# Altium schematic sheet project_pankov_connectors.SchDoc: =title_line_1 + title_line_2
size 594 x 420 mm; SheetNumber: n
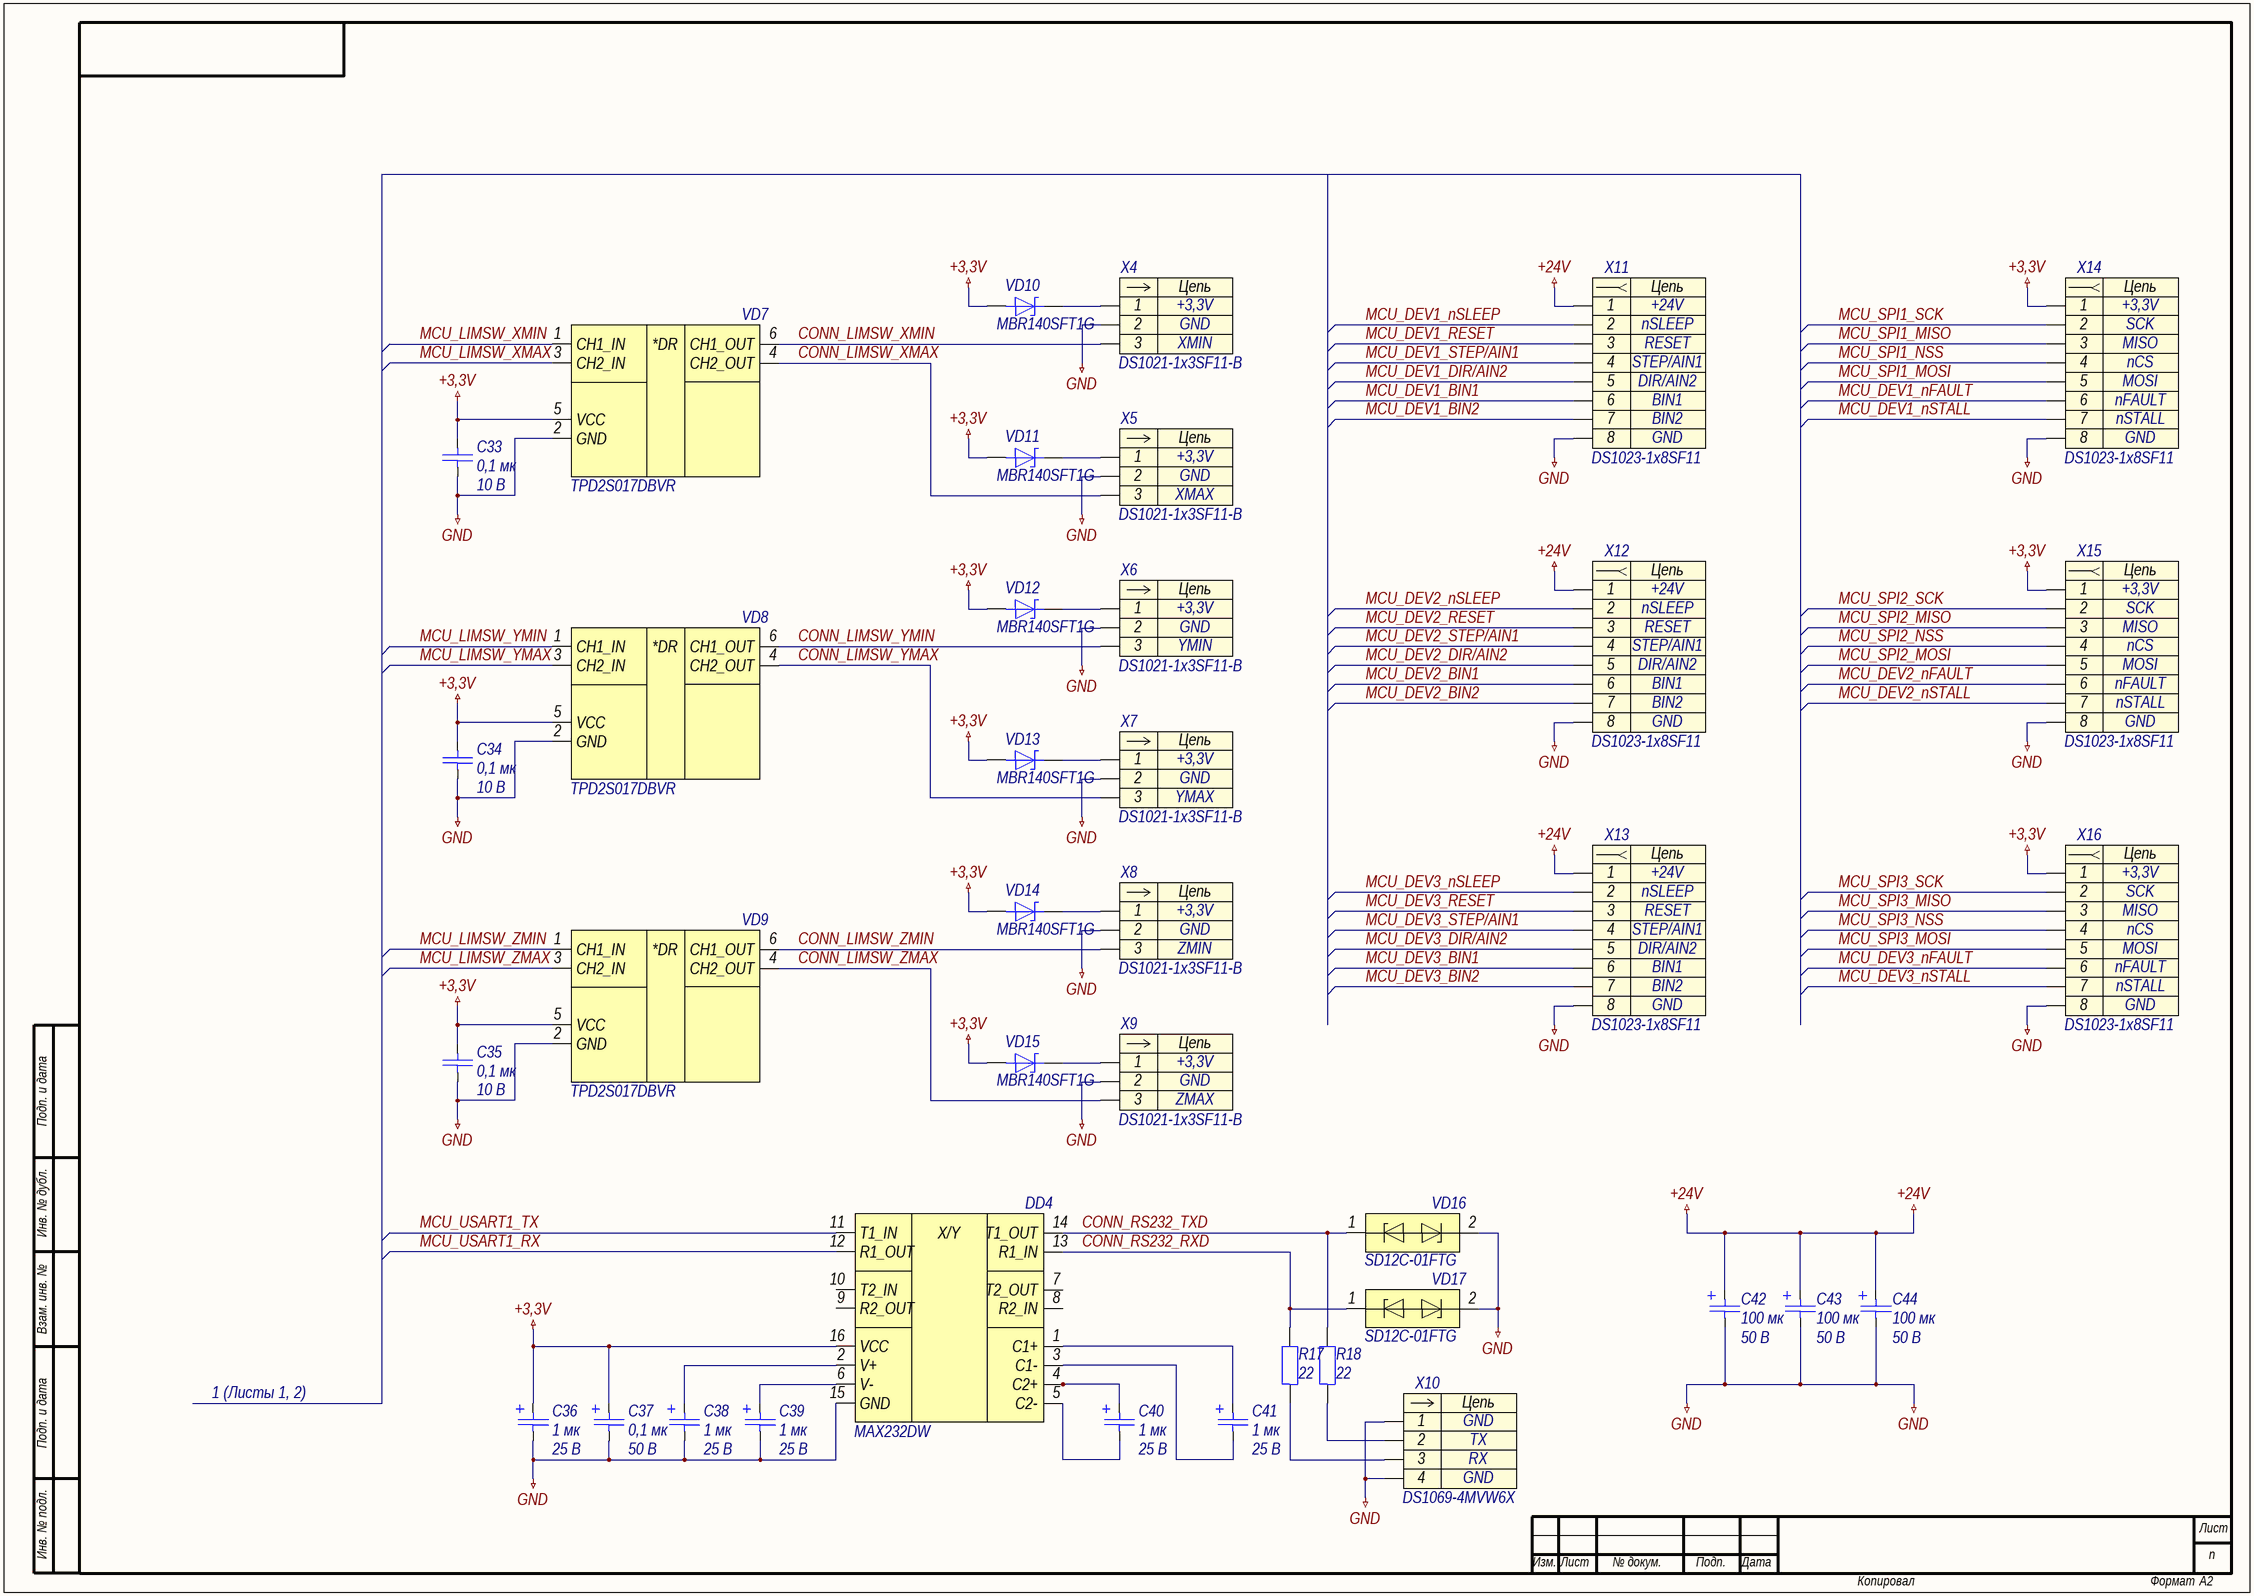
[diagram p0: project_pankov_connectors.SchDoc]

## Parts
C33  0,1 мк  Напряжение: 10 В  [C0603]
C34  0,1 мк  Напряжение: 10 В  [C0603]
C35  0,1 мк  Напряжение: 10 В  [C0603]
C36  1 мк  Напряжение: 25 В  [C3216-18]
C37  0,1 мк  Напряжение: 50 В  [C3216-18]
C38  1 мк  Напряжение: 25 В  [C3216-18]
C39  1 мк  Напряжение: 25 В  [C3216-18]
C40  1 мк  Напряжение: 25 В  [C3216-18]
C41  1 мк  Напряжение: 25 В  [C3216-18]
C42  100 мк  Напряжение: 50 В  [CAPAE-660X660X800]
C43  100 мк  Напряжение: 50 В  [CAPAE-660X660X800]
C44  100 мк  Напряжение: 50 В  [CAPAE-660X660X800]
DD4  MAX232DW  [SOIC-16-P127-1030X750X265-L84X41]
R17  22  [R0603]
R18  22  [R0603]
VD7  TPD2S017DBVR  [SOT-23-6-P95-290X280X145]
VD8  TPD2S017DBVR  [SOT-23-6-P95-290X280X145]
VD9  TPD2S017DBVR  [SOT-23-6-P95-290X280X145]
VD10  MBR140SFT1G  [SOD-123FL-370X165X98]
VD11  MBR140SFT1G  [SOD-123FL-370X165X98]
VD12  MBR140SFT1G  [SOD-123FL-370X165X98]
VD13  MBR140SFT1G  [SOD-123FL-370X165X98]
VD14  MBR140SFT1G  [SOD-123FL-370X165X98]
VD15  MBR140SFT1G  [SOD-123FL-370X165X98]
VD16  SD12C-01FTG  [SOD-323-257X130X114]
VD17  SD12C-01FTG  [SOD-323-257X130X114]
X4  DS1021-1x3SF11-B  [DS1021-1X3SF11-B]
X5  DS1021-1x3SF11-B  [DS1021-1X3SF11-B]
X6  DS1021-1x3SF11-B  [DS1021-1X3SF11-B]
X7  DS1021-1x3SF11-B  [DS1021-1X3SF11-B]
X8  DS1021-1x3SF11-B  [DS1021-1X3SF11-B]
X9  DS1021-1x3SF11-B  [DS1021-1X3SF11-B]
X10  DS1069-4MVW6X  [DS1069-4MVW6X]
X11  DS1023-1x8SF11  [DS1023-1X8SF11]
X12  DS1023-1x8SF11  [DS1023-1X8SF11]
X13  DS1023-1x8SF11  [DS1023-1X8SF11]
X14  DS1023-1x8SF11  [DS1023-1X8SF11]
X15  DS1023-1x8SF11  [DS1023-1X8SF11]
X16  DS1023-1x8SF11  [DS1023-1X8SF11]

## Nets
+3,3V: C33.1 C34.1 C35.1 C36.1 C37.1 DD4.16(VCC) VD7.5(VCC) VD8.5(VCC) VD9.5(VCC) VD10.2 VD11.2 VD12.2 VD13.2 VD14.2 VD15.2 X14.1 X15.1 X16.1
+24V: C42.1 C43.1 C44.1 X11.1 X12.1 X13.1
GND: C33.2 C34.2 C35.2 C36.2 C37.2 C38.2 C39.2 C42.2 C43.2 C44.2 DD4.15(GND) VD7.2(GND) VD8.2(GND) VD9.2(GND) VD16.2 VD17.2 X4.2 X5.2 X6.2 X7.2 X8.2 X9.2 X10.1 X10.4 X11.8 X12.8 X13.8 X14.8 X15.8 X16.8
CONN_LIMSW_XMAX: VD7.4(CH2_OUT) X5.3
CONN_LIMSW_XMIN: VD7.6(CH1_OUT) X4.3
CONN_LIMSW_YMAX: VD8.4(CH2_OUT) X7.3
CONN_LIMSW_YMIN: VD8.6(CH1_OUT) X6.3
CONN_LIMSW_ZMAX: VD9.4(CH2_OUT) X9.3
CONN_LIMSW_ZMIN: VD9.6(CH1_OUT) X8.3
CONN_RS232_RXD: DD4.13(R1_IN) R17.2 VD17.1
CONN_RS232_TXD: DD4.14(T1_OUT) R18.2 VD16.1
MCU_DEV1_BIN1: X11.6
MCU_DEV1_BIN2: X11.7
MCU_DEV1_DIR/AIN2: X11.5
MCU_DEV1_nFAULT: X14.6
MCU_DEV1_nSLEEP: X11.2
MCU_DEV1_nSTALL: X14.7
MCU_DEV1_RESET: X11.3
MCU_DEV1_STEP/AIN1: X11.4
MCU_DEV2_BIN1: X12.6
MCU_DEV2_BIN2: X12.7
MCU_DEV2_DIR/AIN2: X12.5
MCU_DEV2_nFAULT: X15.6
MCU_DEV2_nSLEEP: X12.2
MCU_DEV2_nSTALL: X15.7
MCU_DEV2_RESET: X12.3
MCU_DEV2_STEP/AIN1: X12.4
MCU_DEV3_BIN1: X13.6
MCU_DEV3_BIN2: X13.7
MCU_DEV3_DIR/AIN2: X13.5
MCU_DEV3_nFAULT: X16.6
MCU_DEV3_nSLEEP: X13.2
MCU_DEV3_nSTALL: X16.7
MCU_DEV3_RESET: X13.3
MCU_DEV3_STEP/AIN1: X13.4
MCU_LIMSW_XMAX: VD7.3(CH2_IN)
MCU_LIMSW_XMIN: VD7.1(CH1_IN)
MCU_LIMSW_YMAX: VD8.3(CH2_IN)
MCU_LIMSW_YMIN: VD8.1(CH1_IN)
MCU_LIMSW_ZMAX: VD9.3(CH2_IN)
MCU_LIMSW_ZMIN: VD9.1(CH1_IN)
MCU_SPI1_MISO: X14.3
MCU_SPI1_MOSI: X14.5
MCU_SPI1_NSS: X14.4
MCU_SPI1_SCK: X14.2
MCU_SPI2_MISO: X15.3
MCU_SPI2_MOSI: X15.5
MCU_SPI2_NSS: X15.4
MCU_SPI2_SCK: X15.2
MCU_SPI3_MISO: X16.3
MCU_SPI3_MOSI: X16.5
MCU_SPI3_NSS: X16.4
MCU_SPI3_SCK: X16.2
MCU_USART1_RX: DD4.12(R1_OUT)
MCU_USART1_TX: DD4.11(T1_IN)
NetC38_1: C38.1 DD4.2(V+)
NetC39_1: C39.1 DD4.6(V-)
NetC40_1: C40.1 DD4.4(C2+)
NetC40_2: C40.2 DD4.5(C2-)
NetC41_1: C41.1 DD4.1(C1+)
NetC41_2: C41.2 DD4.3(C1-)
NetR17_1: R17.1 X10.3
NetR18_1: R18.1 X10.2
NetVD10_1: VD10.1 X4.1
NetVD11_1: VD11.1 X5.1
NetVD12_1: VD12.1 X6.1
NetVD13_1: VD13.1 X7.1
NetVD14_1: VD14.1 X8.1
NetVD15_1: VD15.1 X9.1

Not connected (* = marked no-connect by the designer): DD4 7(T2_OUT) 8(R2_IN) 9(R2_OUT) 10(T2_IN)

## Notes on the sheet
- 1 (Листы 1, 2)
- Подп. и дата
- Инв. № дубл.
- Взам. инв. №
- Инв. № подл.
- Лист
- Изм.
- № докум.
- Подп.
- Дата
- Копировал
- Формат
- А2
- (in symbol dd0014) X/Y
- (in symbol vd0016) *DR
- (in symbol x0026) Цепь
- (in symbol x0036) Цепь
- (in symbol x0045) Цепь

## Library data of the parts
C33-C35 = c0077: =Описание; ID: c0077; Фамилия: Паньков; Описание: Конденсатор керамический чип 0603 100 нФ 10 В ±10 %; Наименование: CC0603KRX7R6BB104; Производитель: YAGEO Corp.; Отклонение: ±10 %; Рабочие температуры: от –55 °С до +125 °С; Температурный коэффициент емкости: X7R; Корпус: 0603; Номинал: 0,1 мк; Номинальное напряжение: 10 В; HelpURL: https://www.yageo.com/upload/media/product/productsearch/datasheet/mlcc/UPY-GPHC_X7R_6.3V-to-50V_20.pdf
C36 C38-C41 = c0014: =Описание; ID: c0014; Фамилия: Ларионов; Описание: Конденсатор танталовый чип 3216-18 1 мкФ 25 В ±10 %; Наименование: 293D105X9025A2TE3; Производитель: Vishay Intertechnology, Inc.; Отклонение: ±10 %; Эквивалентное последовательное сопротивление: 7,6 Ом; Среднеквадратичный размах пульсации тока: 0,10 А; Рабочие температуры: от –55 °С до +125 °С; Корпус: 3216-18; Номинал: 1 мк; Номинальное напряжение: 25 В; HelpURL: https://www.vishay.com/capacitors/list/product-40002/
C37 = c0001: =Описание; ID: c0001; Фамилия: Ларионов; Описание: Конденсатор танталовый чип 3216-18 100 нФ 50 В ±10 %; Наименование: 293D104X9050A2TE3; Производитель: Vishay Intertechnology, Inc.; Отклонение: ±10 %; Эквивалентное последовательное сопротивление: 19,0 Ом; Среднеквадратичный размах пульсации тока: 0,06 А; Рабочие температуры: от –55 °С до +125 °С; Корпус: 3216-18; Номинал: 0,1 мк; Номинальное напряжение: 50 В; HelpURL: https://www.vishay.com/capacitors/list/product-40002/
C42-C44 = c0168: =Описание; ID: c0168; Фамилия: Паньков; Описание: Конденсатор электролитический алюминиевый 100 мкФ 50 В ±20 %; Наименование: EEEFTH101XAP; Производитель: Panasonic Corporation; Отклонение: ±20 %; Эквивалентное последовательное сопротивление: 0,34 Ом; Среднеквадратичный размах пульсации тока: 0,35 А; Рабочие температуры: от –55 °С до +105 °С; Корпус: CAPAE (6,6 x 6,6 x 8,0); Номинал: 100 мк; Номинальное напряжение: 50 В; HelpURL: https://industrial.panasonic.com/ww/products/capacitors/aluminum-capacitors/aluminum-cap-smd/models/EEEFTH101XAP
DD4 = dd0014: =Описание; ID: dd0014; Фамилия: Паньков; Описание: Приемопередатчик RS-232; Производитель: Texas Instruments Inc.; Рабочие температуры: от 0 до +70 °C; Корпус: SOIC-16; Наименование: MAX232DW; HelpURL: https://www.ti.com/product/MAX232
R17 R18 = r0004: =Описание; ID: r0004; Фамилия: Ларионов; Описание: Резистор чип 0603 22 Ом ±1 % 0,1 Вт; Наименование: RC0603FR-0722RL; Производитель: YAGEO Corp.; Отклонение: ±1 %; Номинальное напряжение: 75 В; Номинальный ток: 1 А; Рабочие температуры: от –55 °С до +155 °С; Корпус: 0603; Примечание: Ряд E24; Номинал: 22; HelpURL: https://www.yageo.com/upload/media/product/productsearch/datasheet/rchip/PYu-RC_Group_51_RoHS_L_11.pdf
VD7-VD9 = vd0016: =Описание; ID: vd0016; Фамилия: Паньков; Описание: Диодная сборка для подавления помех 5 В; Производитель: Texas Instruments Inc.; Корпус: SOT-23-6; Наименование: TPD2S017DBVR; HelpURL: https://www.ti.com/product/TPD2S017
VD10-VD15 = vd0002: =Описание; ID: vd0002; Фамилия: Паньков; Описание: Диод Шоттки 40 В 1 А; Производитель: ON Semiconductor; Максимальное прямое напряжение: 0,88 В; Максимальное обратное напряжение: 40 В; Максимальный прямой ток: 1 А; Рабочие температуры: от –55 °С до +125 °С; Корпус: SOD-123FL; Наименование: MBR140SFT1G; HelpURL: https://www.onsemi.com/products/discretes-drivers/diodes-rectifiers/schottky-diodes-schottky-rectifiers/mbr140sf
VD16 VD17 = vd0004: =Описание; ID: vd0004; Фамилия: Ларионов; Описание: Двунаправленная диодная сборка для подавления помех 12 В; Производитель: Littelfuse, Inc.; Корпус: SOD-323; Наименование: SD12C-01FTG; HelpURL: https://www.littelfuse.com/products/tvs-diode-arrays/general-purpose-esd-protection/sdc/sd12c_01ftg.aspx
X4 = x0026: =Описание; Contact_1: +3,3V; Contact_2: GND; Contact_3: XMIN; ID: x0026; Фамилия: Паньков; Описание: PLS 3 pin 2,54 мм вилка прямой; Производитель: Connfly Electronic Co., Ltd.; Наименование: DS1021-1x3SF11-B; HelpURL: http://en.connfly.group/product/xVkr=EusQssAN0gN=Aos=mU+UrVkR9kqEAN0gN9g+WqANB+A
X5 = x0026: =Описание; Contact_1: +3,3V; Contact_2: GND; Contact_3: XMAX; ID: x0026; Фамилия: Паньков; Описание: PLS 3 pin 2,54 мм вилка прямой; Производитель: Connfly Electronic Co., Ltd.; Наименование: DS1021-1x3SF11-B; HelpURL: http://en.connfly.group/product/xVkr=EusQssAN0gN=Aos=mU+UrVkR9kqEAN0gN9g+WqANB+A
X6 = x0026: =Описание; Contact_1: +3,3V; Contact_2: GND; Contact_3: YMIN; ID: x0026; Фамилия: Паньков; Описание: PLS 3 pin 2,54 мм вилка прямой; Производитель: Connfly Electronic Co., Ltd.; Наименование: DS1021-1x3SF11-B; HelpURL: http://en.connfly.group/product/xVkr=EusQssAN0gN=Aos=mU+UrVkR9kqEAN0gN9g+WqANB+A
X7 = x0026: =Описание; Contact_1: +3,3V; Contact_2: GND; Contact_3: YMAX; ID: x0026; Фамилия: Паньков; Описание: PLS 3 pin 2,54 мм вилка прямой; Производитель: Connfly Electronic Co., Ltd.; Наименование: DS1021-1x3SF11-B; HelpURL: http://en.connfly.group/product/xVkr=EusQssAN0gN=Aos=mU+UrVkR9kqEAN0gN9g+WqANB+A
X8 = x0026: =Описание; Contact_1: +3,3V; Contact_2: GND; Contact_3: ZMIN; ID: x0026; Фамилия: Паньков; Описание: PLS 3 pin 2,54 мм вилка прямой; Производитель: Connfly Electronic Co., Ltd.; Наименование: DS1021-1x3SF11-B; HelpURL: http://en.connfly.group/product/xVkr=EusQssAN0gN=Aos=mU+UrVkR9kqEAN0gN9g+WqANB+A
X9 = x0026: =Описание; Contact_1: +3,3V; Contact_2: GND; Contact_3: ZMAX; ID: x0026; Фамилия: Паньков; Описание: PLS 3 pin 2,54 мм вилка прямой; Производитель: Connfly Electronic Co., Ltd.; Наименование: DS1021-1x3SF11-B; HelpURL: http://en.connfly.group/product/xVkr=EusQssAN0gN=Aos=mU+UrVkR9kqEAN0gN9g+WqANB+A
X10 = x0045: =Описание; Contact_1: GND; Contact_2: TX; Contact_3: RX; ID: x0045; Фамилия: Паньков; Описание: CWF 4 pin 2,5 мм вилка прямой; Производитель: Connfly Electronic Co., Ltd.; Contact_4: GND; Наименование: DS1069-4MVW6X; HelpURL: http://en.connfly.group/product/xVkr=EusQssAN0gN=Aos=mU+UrVkR9kqEAN0gN0MUR+g+NB+A
X11-X13 = x0036: =Описание; Contact_1: +24V; Contact_2: nSLEEP; Contact_3: RESET; Contact_4: STEP/AIN1; Contact_5: DIR/AIN2; Contact_6: BIN1; Contact_7: BIN2; Contact_8: GND; ID: x0036; Фамилия: Паньков; Описание: PBS 8 pin 2,54 мм гнездо прямой; Производитель: Connfly Electronic Co., Ltd.; Наименование: DS1023-1x8SF11; HelpURL: http://en.connfly.group/product/xVkr=EusQssAN0gN=Aos=mU+UrVkR9kqEAN0gN0AUCUNB+A
X14-X16 = x0036: =Описание; Contact_1: +3,3V; Contact_2: SCK; Contact_3: MISO; Contact_4: nCS; Contact_5: MOSI; Contact_6: nFAULT; Contact_7: nSTALL; Contact_8: GND; ID: x0036; Фамилия: Паньков; Описание: PBS 8 pin 2,54 мм гнездо прямой; Производитель: Connfly Electronic Co., Ltd.; Наименование: DS1023-1x8SF11; HelpURL: http://en.connfly.group/product/xVkr=EusQssAN0gN=Aos=mU+UrVkR9kqEAN0gN0AUCUNB+A